# Altium project Twintig-Carpus.PrjPcb
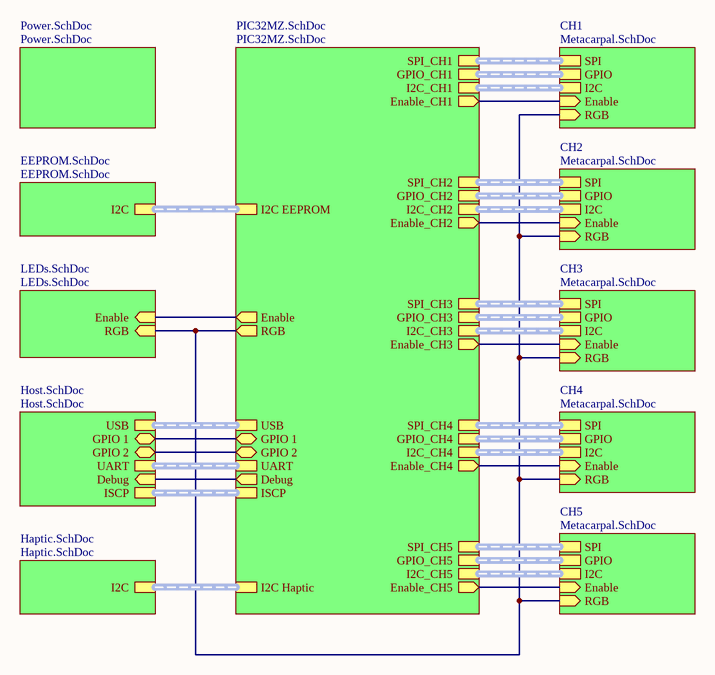
[diagram p0: Main.SchDoc]
Version: v1.0.1; Project: Twintig Carpus; Author: Seb Madgwick
8 sheets, 72 parts. Net scope: hierarchical (ports join the sheet entries above them; power ports are global).
Board file: Twintig-Carpus.PcbDoc
Sheets:
  Main.SchDoc
    PIC32MZ.SchDoc = PIC32MZ.SchDoc
    Power.SchDoc = Power.SchDoc
    CH1 = Metacarpal.SchDoc
    EEPROM.SchDoc = EEPROM.SchDoc
    LEDs.SchDoc = LEDs.SchDoc
    Haptic.SchDoc = Haptic.SchDoc
    Host.SchDoc = Host.SchDoc
    CH2 = Metacarpal.SchDoc
    CH3 = Metacarpal.SchDoc
    CH4 = Metacarpal.SchDoc
    CH5 = Metacarpal.SchDoc

## Sheet Main.SchDoc
size A4; SheetNumber: 1; SheetTotal: 8

### Sub-sheets
CH1 = Metacarpal.SchDoc: I2C (harness I2C), SPI (harness SPI), GPIO (harness GPIO), RGB (in), Enable (in)
CH2 = Metacarpal.SchDoc: I2C (harness I2C), SPI (harness SPI), GPIO (harness GPIO), RGB (in), Enable (in)
CH3 = Metacarpal.SchDoc: I2C (harness I2C), SPI (harness SPI), GPIO (harness GPIO), RGB (in), Enable (in)
CH4 = Metacarpal.SchDoc: I2C (harness I2C), SPI (harness SPI), GPIO (harness GPIO), RGB (in), Enable (in)
CH5 = Metacarpal.SchDoc: I2C (harness I2C), SPI (harness SPI), GPIO (harness GPIO), RGB (in), Enable (in)
EEPROM.SchDoc = EEPROM.SchDoc: I2C (harness I2C)
Haptic.SchDoc = Haptic.SchDoc: I2C (harness I2C)
Host.SchDoc = Host.SchDoc: UART (harness UART), USB (harness USB), ISCP (harness ICSP), Debug (in), GPIO 1 (bidir), GPIO 2 (bidir)
LEDs.SchDoc = LEDs.SchDoc: RGB (in), Enable (in)
PIC32MZ.SchDoc = PIC32MZ.SchDoc: I2C EEPROM (harness I2C), I2C Haptic (harness I2C), SPI_CH1 (harness SPI), GPIO_CH1 (harness GPIO), I2C_CH1 (harness I2C), SPI_CH2 (harness SPI), GPIO_CH2 (harness GPIO), I2C_CH2 (harness I2C), SPI_CH3 (harness SPI), GPIO_CH3 (harness GPIO), I2C_CH3 (harness I2C), SPI_CH4 (harness SPI), GPIO_CH4 (harness GPIO), I2C_CH4 (harness I2C), SPI_CH5 (harness SPI), GPIO_CH5 (harness GPIO), I2C_CH5 (harness I2C), UART (harness UART), USB (harness USB), ISCP (harness ICSP), RGB (out), Enable (out), Enable_CH1 (out), Enable_CH2 (out), Enable_CH5 (out), Enable_CH4 (out), Enable_CH3 (out), Debug (out), GPIO 2 (bidir), GPIO 1 (bidir)
Power.SchDoc = Power.SchDoc: no entries

### Nets
Debug: sheet PIC32MZ.SchDoc/Debug, sheet Host.SchDoc/Debug
Enable: sheet PIC32MZ.SchDoc/Enable_CH5, sheet CH5/Enable
Enable: sheet PIC32MZ.SchDoc/Enable_CH4, sheet CH4/Enable  [a separate net that carries the same name]
Enable: sheet PIC32MZ.SchDoc/Enable_CH3, sheet CH3/Enable  [a separate net that carries the same name]
Enable: sheet PIC32MZ.SchDoc/Enable_CH2, sheet CH2/Enable  [a separate net that carries the same name]
Enable: sheet PIC32MZ.SchDoc/Enable_CH1, sheet CH1/Enable  [a separate net that carries the same name]
Enable: sheet PIC32MZ.SchDoc/Enable, sheet LEDs.SchDoc/Enable  [a separate net that carries the same name]
GPIO 1: sheet PIC32MZ.SchDoc/GPIO 1, sheet Host.SchDoc/GPIO 1
GPIO 2: sheet PIC32MZ.SchDoc/GPIO 2, sheet Host.SchDoc/GPIO 2
RGB: sheet PIC32MZ.SchDoc/RGB, sheet CH1/RGB, sheet LEDs.SchDoc/RGB, sheet CH2/RGB, sheet CH3/RGB, sheet CH4/RGB, sheet CH5/RGB

### Buses and harness runs
harness sheet CH1/GPIO = sheet PIC32MZ.SchDoc/GPIO_CH1
harness sheet CH1/I2C = sheet PIC32MZ.SchDoc/I2C_CH1
harness sheet CH1/SPI = sheet PIC32MZ.SchDoc/SPI_CH1
harness sheet CH2/GPIO = sheet PIC32MZ.SchDoc/GPIO_CH2
harness sheet CH2/I2C = sheet PIC32MZ.SchDoc/I2C_CH2
harness sheet CH2/SPI = sheet PIC32MZ.SchDoc/SPI_CH2
harness sheet CH3/GPIO = sheet PIC32MZ.SchDoc/GPIO_CH3
harness sheet CH3/I2C = sheet PIC32MZ.SchDoc/I2C_CH3
harness sheet CH3/SPI = sheet PIC32MZ.SchDoc/SPI_CH3
harness sheet CH4/GPIO = sheet PIC32MZ.SchDoc/GPIO_CH4
harness sheet CH4/I2C = sheet PIC32MZ.SchDoc/I2C_CH4
harness sheet CH4/SPI = sheet PIC32MZ.SchDoc/SPI_CH4
harness sheet CH5/GPIO = sheet PIC32MZ.SchDoc/GPIO_CH5
harness sheet CH5/I2C = sheet PIC32MZ.SchDoc/I2C_CH5
harness sheet CH5/SPI = sheet PIC32MZ.SchDoc/SPI_CH5
harness sheet EEPROM.SchDoc/I2C = sheet PIC32MZ.SchDoc/I2C EEPROM
harness sheet Haptic.SchDoc/I2C = sheet PIC32MZ.SchDoc/I2C Haptic
harness sheet Host.SchDoc/ISCP = sheet PIC32MZ.SchDoc/ISCP
harness sheet Host.SchDoc/UART = sheet PIC32MZ.SchDoc/UART
harness sheet Host.SchDoc/USB = sheet PIC32MZ.SchDoc/USB

### Notes on the sheet
- TITLE
- SIZE
- A4
- VARIANT
- PROJECT
- SHEET
- VERSION
- OF
- AUTHOR
- DATE

## Sheet PIC32MZ.SchDoc
size A3; SheetNumber: 2; SheetTotal: 8
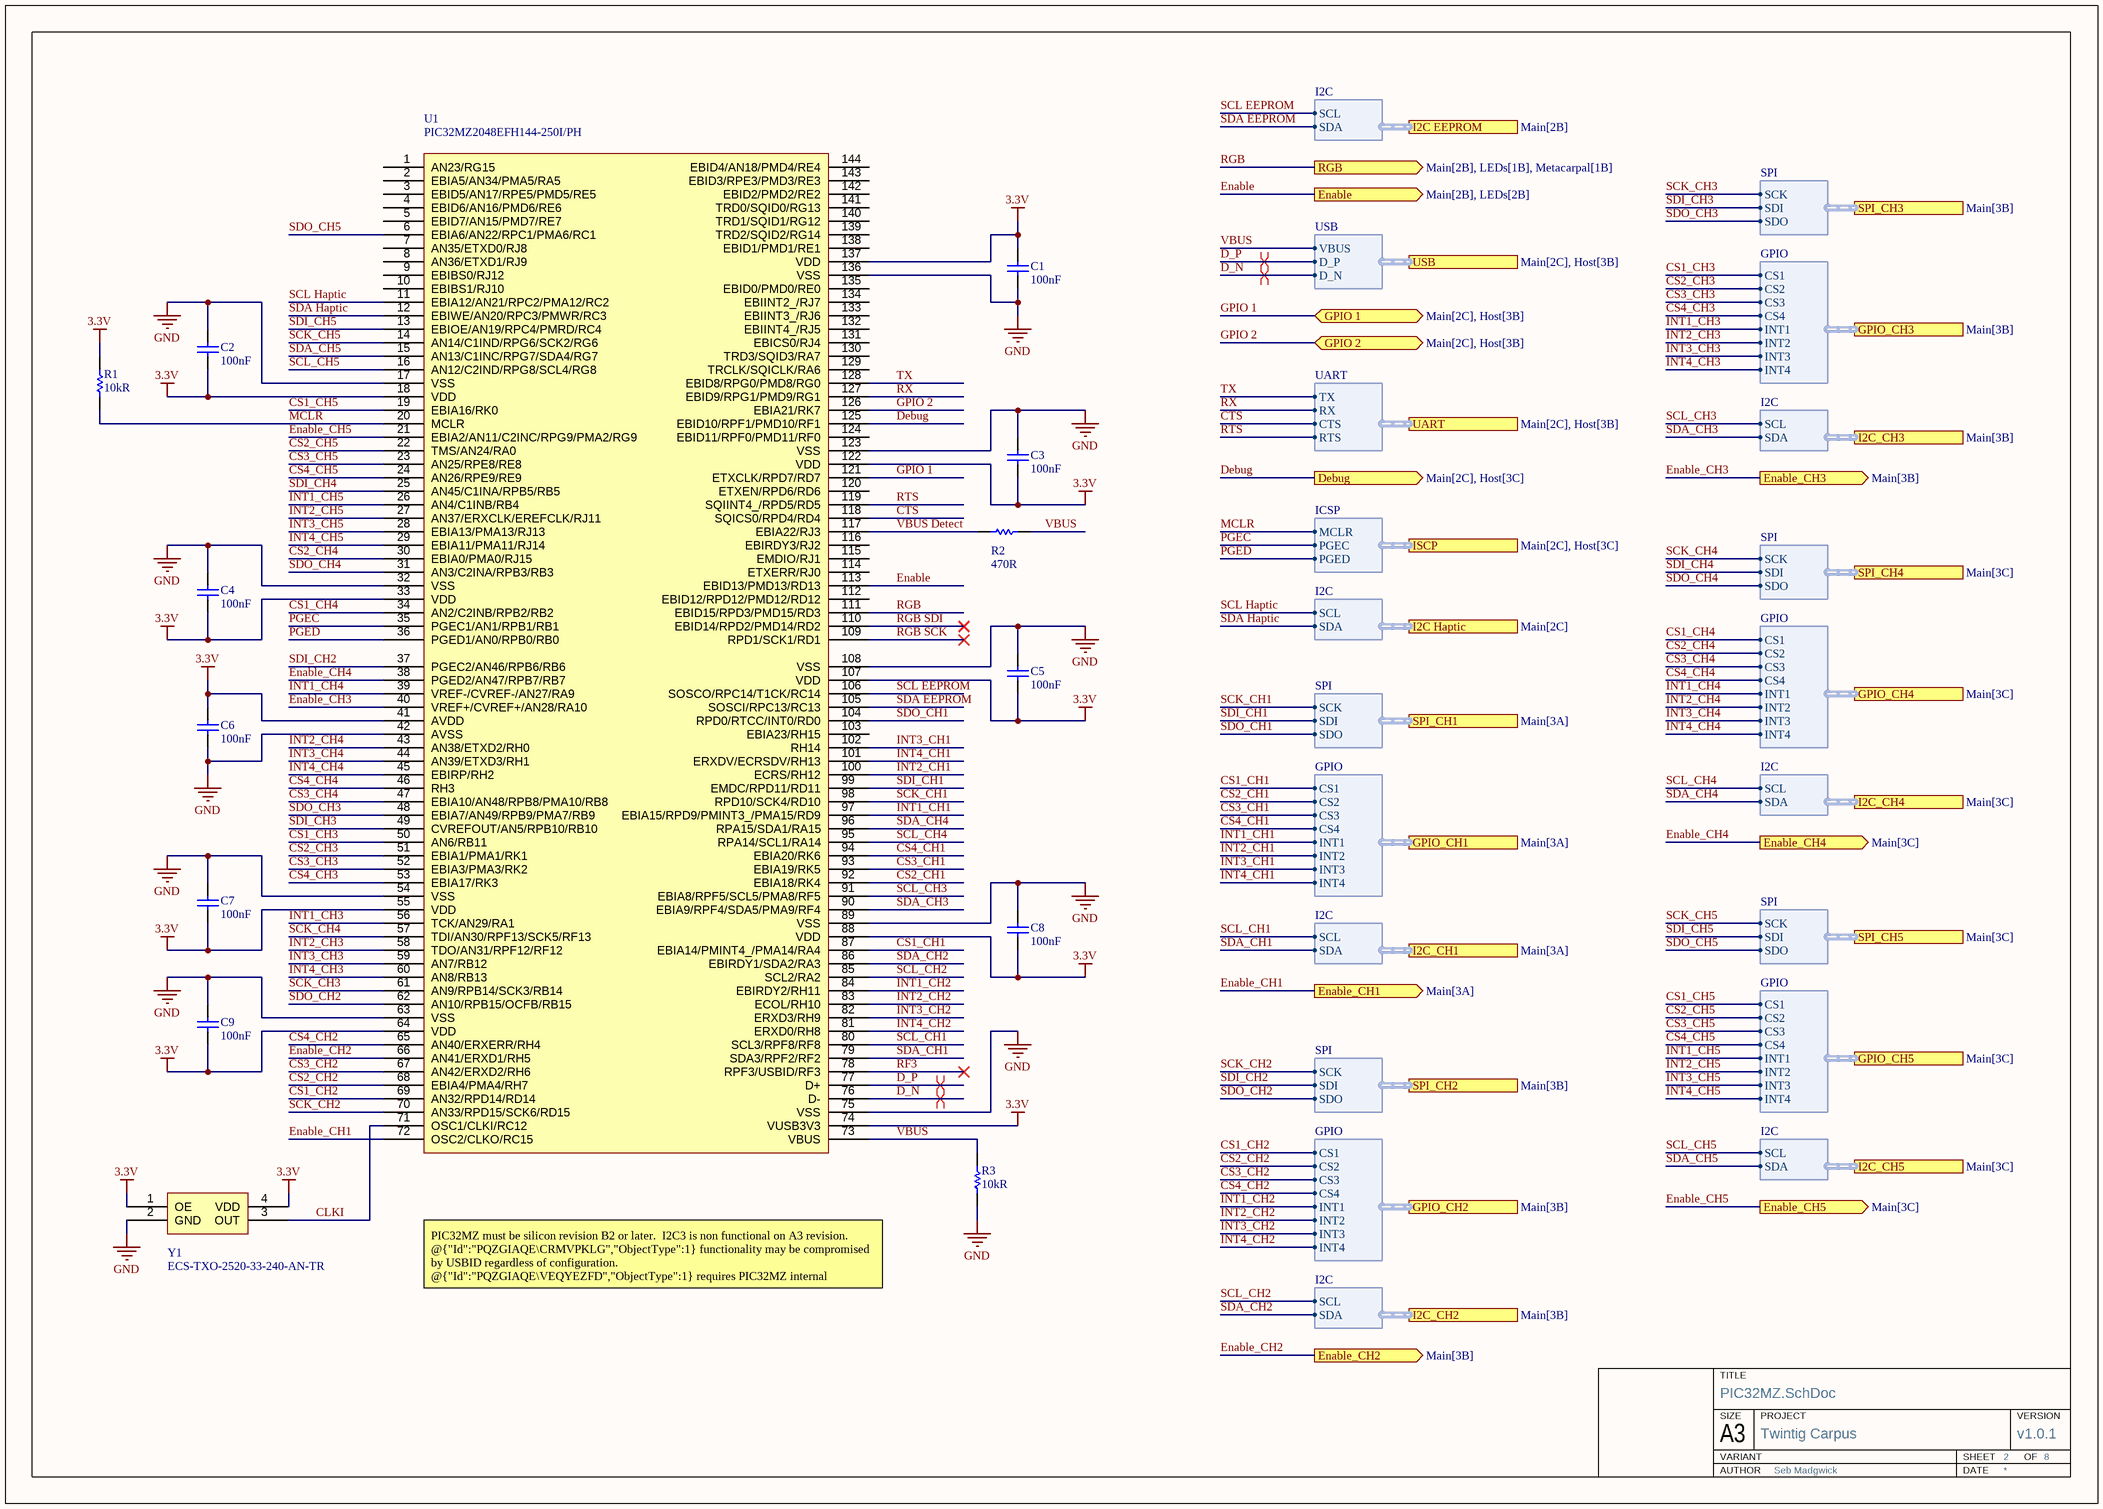
[diagram p1: PIC32MZ.SchDoc]

### Parts
C1  100nF  [Capacitor 0402]
C2  100nF  [Capacitor 0402]
C3  100nF  [Capacitor 0402]
C4  100nF  [Capacitor 0402]
C5  100nF  [Capacitor 0402]
C6  100nF  [Capacitor 0402]
C7  100nF  [Capacitor 0402]
C8  100nF  [Capacitor 0402]
C9  100nF  [Capacitor 0402]
R1  10kR  [Resistor 0402]
R2  470R  [Resistor 0402]
R3  10kR  [Resistor 0402]
U1  PIC32MZ2048EFH144-250I/PH  [TQFP-144 0.4mm]
Y1  ECS-TXO-2520-33-240-AN-TR  [ECS 2x2.5mm]

### Ports
Debug (out, see Main[2C], Host[3C]), Enable (out, see Main[2B], LEDs[2B]), Enable_CH1 (out, see Main[3A]), Enable_CH2 (out, see Main[3B]), Enable_CH3 (out, see Main[3B]), Enable_CH4 (out, see Main[3C]), Enable_CH5 (out, see Main[3C]), GPIO 1 (bidir, see Main[2C], Host[3B]), GPIO 2 (bidir, see Main[2C], Host[3B]), GPIO_CH1 (harness GPIO, see Main[3A]), GPIO_CH2 (harness GPIO, see Main[3B]), GPIO_CH3 (harness GPIO, see Main[3B]), GPIO_CH4 (harness GPIO, see Main[3C]), GPIO_CH5 (harness GPIO, see Main[3C]), I2C EEPROM (harness I2C, see Main[2B]), I2C Haptic (harness I2C, see Main[2C]), I2C_CH1 (harness I2C, see Main[3A]), I2C_CH2 (harness I2C, see Main[3B]), I2C_CH3 (harness I2C, see Main[3B]), I2C_CH4 (harness I2C, see Main[3C]), I2C_CH5 (harness I2C, see Main[3C]), ISCP (harness ICSP, see Main[2C], Host[3C]), RGB (out, see Main[2B], LEDs[1B], Metacarpal[1B]), SPI_CH1 (harness SPI, see Main[3A]), SPI_CH2 (harness SPI, see Main[3B]), SPI_CH3 (harness SPI, see Main[3B]), SPI_CH4 (harness SPI, see Main[3C]), SPI_CH5 (harness SPI, see Main[3C]), UART (harness UART, see Main[2C], Host[3B]), USB (harness USB, see Main[2C], Host[3B])

### Harnesses
I2C: SCL, SDA
SPI: SCK, SDI, SDO
GPIO: CS1, CS2, CS3, CS4, INT1, INT2, INT3, INT4
UART: TX, RX, CTS, RTS
USB: VBUS, D_P, D_N
ICSP: MCLR, PGEC, PGED

### Nets
3.3V: C1.2 C2.1 C3.1 C4.1 C5.1 C6.2 C7.1 C8.1 C9.1 R1.2 U1.18(VDD) U1.33(VDD) U1.41(AVDD) U1.55(VDD) U1.64(VDD) U1.74(VUSB3V3) U1.88(VDD) U1.107(VDD) U1.122(VDD) U1.137(VDD) Y1.1(OE) Y1.4(VDD)
GND: C1.1 C2.2 C3.2 C4.2 C5.2 C6.1 C7.2 C8.2 C9.2 R3.1 U1.17(VSS) U1.32(VSS) U1.42(AVSS) U1.54(VSS) U1.63(VSS) U1.75(VSS) U1.89(VSS) U1.108(VSS) U1.123(VSS) U1.136(VSS) Y1.2(GND)
CLKI: U1.71(OSC1/CLKI/RC12) Y1.3(OUT)
CS1_CH1: U1.87(EBIA14/PMINT4_/PMA14/RA4) ; port GPIO_CH1.CS1  [project net CS1]
CS1_CH2: U1.69(AN32/RPD14/RD14) ; port GPIO_CH2.CS1  [project net CS1]
CS1_CH3: U1.50(AN6/RB11) ; port GPIO_CH3.CS1  [project net CS1]
CS1_CH4: U1.34(AN2/C2INB/RPB2/RB2) ; port GPIO_CH4.CS1  [project net CS1]
CS1_CH5: U1.19(EBIA16/RK0) ; port GPIO_CH5.CS1  [project net CS1]
CS2_CH1: U1.92(EBIA18/RK4) ; port GPIO_CH1.CS2  [project net CS2]
CS2_CH2: U1.68(EBIA4/PMA4/RH7) ; port GPIO_CH2.CS2  [project net CS2]
CS2_CH3: U1.51(EBIA1/PMA1/RK1) ; port GPIO_CH3.CS2  [project net CS2]
CS2_CH4: U1.30(EBIA0/PMA0/RJ15) ; port GPIO_CH4.CS2  [project net CS2]
CS2_CH5: U1.22(TMS/AN24/RA0) ; port GPIO_CH5.CS2  [project net CS2]
CS3_CH1: U1.93(EBIA19/RK5) ; port GPIO_CH1.CS3  [project net CS3]
CS3_CH2: U1.67(AN42/ERXD2/RH6) ; port GPIO_CH2.CS3  [project net CS3]
CS3_CH3: U1.52(EBIA3/PMA3/RK2) ; port GPIO_CH3.CS3  [project net CS3]
CS3_CH4: U1.47(EBIA10/AN48/RPB8/PMA10/RB8) ; port GPIO_CH4.CS3  [project net CS3]
CS3_CH5: U1.23(AN25/RPE8/RE8) ; port GPIO_CH5.CS3  [project net CS3]
CS4_CH1: U1.94(EBIA20/RK6) ; port GPIO_CH1.CS4  [project net CS4]
CS4_CH2: U1.65(AN40/ERXERR/RH4) ; port GPIO_CH2.CS4  [project net CS4]
CS4_CH3: U1.53(EBIA17/RK3) ; port GPIO_CH3.CS4  [project net CS4]
CS4_CH4: U1.46(RH3) ; port GPIO_CH4.CS4  [project net CS4]
CS4_CH5: U1.24(AN26/RPE9/RE9) ; port GPIO_CH5.CS4  [project net CS4]
CTS: U1.118(SQICS0/RPD4/RD4) ; port UART.CTS
D_N: U1.76(D-) ; port USB.D_N
D_P: U1.77(D+) ; port USB.D_P
Debug: U1.125(EBID10/RPF1/PMD10/RF1) ; port Debug
Enable: U1.113(EBID13/PMD13/RD13) ; port Enable
Enable_CH1: U1.72(OSC2/CLKO/RC15) ; port Enable_CH1  [project net Enable]
Enable_CH2: U1.66(AN41/ERXD1/RH5) ; port Enable_CH2  [project net Enable]
Enable_CH3: U1.40(VREF+/CVREF+/AN28/RA10) ; port Enable_CH3  [project net Enable]
Enable_CH4: U1.38(PGED2/AN47/RPB7/RB7) ; port Enable_CH4  [project net Enable]
Enable_CH5: U1.21(EBIA2/AN11/C2INC/RPG9/PMA2/RG9) ; port Enable_CH5  [project net Enable]
GPIO 1: U1.121(ETXCLK/RPD7/RD7) ; port GPIO 1
GPIO 2: U1.126(EBIA21/RK7) ; port GPIO 2
INT1_CH1: U1.97(EBIA15/RPD9/PMINT3_/PMA15/RD9) ; port GPIO_CH1.INT1  [project net INT1]
INT1_CH2: U1.84(EBIRDY2/RH11) ; port GPIO_CH2.INT1  [project net INT1]
INT1_CH3: U1.56(TCK/AN29/RA1) ; port GPIO_CH3.INT1  [project net INT1]
INT1_CH4: U1.39(VREF-/CVREF-/AN27/RA9) ; port GPIO_CH4.INT1  [project net INT1]
INT1_CH5: U1.26(AN4/C1INB/RB4) ; port GPIO_CH5.INT1  [project net INT1]
INT2_CH1: U1.100(ECRS/RH12) ; port GPIO_CH1.INT2  [project net INT2]
INT2_CH2: U1.83(ECOL/RH10) ; port GPIO_CH2.INT2  [project net INT2]
INT2_CH3: U1.58(TDO/AN31/RPF12/RF12) ; port GPIO_CH3.INT2  [project net INT2]
INT2_CH4: U1.43(AN38/ETXD2/RH0) ; port GPIO_CH4.INT2  [project net INT2]
INT2_CH5: U1.27(AN37/ERXCLK/EREFCLK/RJ11) ; port GPIO_CH5.INT2  [project net INT2]
INT3_CH1: U1.102(RH14) ; port GPIO_CH1.INT3  [project net INT3]
INT3_CH2: U1.82(ERXD3/RH9) ; port GPIO_CH2.INT3  [project net INT3]
INT3_CH3: U1.59(AN7/RB12) ; port GPIO_CH3.INT3  [project net INT3]
INT3_CH4: U1.44(AN39/ETXD3/RH1) ; port GPIO_CH4.INT3  [project net INT3]
INT3_CH5: U1.28(EBIA13/PMA13/RJ13) ; port GPIO_CH5.INT3  [project net INT3]
INT4_CH1: U1.101(ERXDV/ECRSDV/RH13) ; port GPIO_CH1.INT4  [project net INT4]
INT4_CH2: U1.81(ERXD0/RH8) ; port GPIO_CH2.INT4  [project net INT4]
INT4_CH3: U1.60(AN8/RB13) ; port GPIO_CH3.INT4  [project net INT4]
INT4_CH4: U1.45(EBIRP/RH2) ; port GPIO_CH4.INT4  [project net INT4]
INT4_CH5: U1.29(EBIA11/PMA11/RJ14) ; port GPIO_CH5.INT4  [project net INT4]
MCLR: R1.1 U1.20(MCLR) ; port ISCP.MCLR
PGEC: U1.35(PGEC1/AN1/RPB1/RB1) ; port ISCP.PGEC
PGED: U1.36(PGED1/AN0/RPB0/RB0) ; port ISCP.PGED
RF3: U1.78(RPF3/USBID/RF3)
RGB: U1.111(EBID15/RPD3/PMD15/RD3) ; port RGB
RGB SCK: U1.109(RPD1/SCK1/RD1)
RGB SDI: U1.110(EBID14/RPD2/PMD14/RD2)
RTS: U1.119(SQIINT4_/RPD5/RD5) ; port UART.RTS
RX: U1.127(EBID9/RPG1/PMD9/RG1) ; port UART.RX
SCK_CH1: U1.98(RPD10/SCK4/RD10) ; port SPI_CH1.SCK  [project net SCK]
SCK_CH2: U1.70(AN33/RPD15/SCK6/RD15) ; port SPI_CH2.SCK  [project net SCK]
SCK_CH3: U1.61(AN9/RPB14/SCK3/RB14) ; port SPI_CH3.SCK  [project net SCK]
SCK_CH4: U1.57(TDI/AN30/RPF13/SCK5/RF13) ; port SPI_CH4.SCK  [project net SCK]
SCK_CH5: U1.14(AN14/C1IND/RPG6/SCK2/RG6) ; port SPI_CH5.SCK  [project net SCK]
SCL EEPROM: U1.106(SOSCO/RPC14/T1CK/RC14) ; port I2C EEPROM.SCL
SCL Haptic: U1.11(EBIA12/AN21/RPC2/PMA12/RC2) ; port I2C Haptic.SCL
SCL_CH1: U1.80(SCL3/RPF8/RF8) ; port I2C_CH1.SCL  [project net SCL]
SCL_CH2: U1.85(SCL2/RA2) ; port I2C_CH2.SCL  [project net SCL]
SCL_CH3: U1.91(EBIA8/RPF5/SCL5/PMA8/RF5) ; port I2C_CH3.SCL  [project net SCL]
SCL_CH4: U1.95(RPA14/SCL1/RA14) ; port I2C_CH4.SCL  [project net SCL]
SCL_CH5: U1.16(AN12/C2IND/RPG8/SCL4/RG8) ; port I2C_CH5.SCL  [project net SCL]
SDA EEPROM: U1.105(SOSCI/RPC13/RC13)
SDA Haptic: U1.12(EBIWE/AN20/RPC3/PMWR/RC3)
SDA_CH1: U1.79(SDA3/RPF2/RF2)
SDA_CH2: U1.86(EBIRDY1/SDA2/RA3)
SDA_CH3: U1.90(EBIA9/RPF4/SDA5/PMA9/RF4)
SDA_CH4: U1.96(RPA15/SDA1/RA15)
SDA_CH5: U1.15(AN13/C1INC/RPG7/SDA4/RG7)
SDI_CH1: U1.99(EMDC/RPD11/RD11) ; port SPI_CH1.SDI  [project net SDI]
SDI_CH2: U1.37(PGEC2/AN46/RPB6/RB6) ; port SPI_CH2.SDI  [project net SDI]
SDI_CH3: U1.49(CVREFOUT/AN5/RPB10/RB10) ; port SPI_CH3.SDI  [project net SDI]
SDI_CH4: U1.25(AN45/C1INA/RPB5/RB5) ; port SPI_CH4.SDI  [project net SDI]
SDI_CH5: U1.13(EBIOE/AN19/RPC4/PMRD/RC4) ; port SPI_CH5.SDI  [project net SDI]
SDO_CH1: U1.104(RPD0/RTCC/INT0/RD0) ; port SPI_CH1.SDO  [project net SDO]
SDO_CH2: U1.62(AN10/RPB15/OCFB/RB15) ; port SPI_CH2.SDO  [project net SDO]
SDO_CH3: U1.48(EBIA7/AN49/RPB9/PMA7/RB9) ; port SPI_CH3.SDO  [project net SDO]
SDO_CH4: U1.31(AN3/C2INA/RPB3/RB3) ; port SPI_CH4.SDO  [project net SDO]
SDO_CH5: U1.6(EBIA6/AN22/RPC1/PMA6/RC1) ; port SPI_CH5.SDO  [project net SDO]
TX: U1.128(EBID8/RPG0/PMD8/RG0) ; port UART.TX
VBUS: R2.1 R3.2 U1.73(VBUS) ; port USB.VBUS
VBUS Detect: R2.2 U1.117(EBIA22/RJ3)

Not connected (* = marked no-connect by the designer): U1 1(AN23/RG15) 2(EBIA5/AN34/PMA5/RA5) 3(EBID5/AN17/RPE5/PMD5/RE5) 4(EBID6/AN16/PMD6/RE6) 5(EBID7/AN15/PMD7/RE7) 7(AN35/ETXD0/RJ8) 8(AN36/ETXD1/RJ9) 9(EBIBS0/RJ12) 10(EBIBS1/RJ10) 103(EBIA23/RH15) 112(EBID12/RPD12/PMD12/RD12) 114(ETXERR/RJ0) 115(EMDIO/RJ1) 116(EBIRDY3/RJ2) 120(ETXEN/RPD6/RD6) 124(EBID11/RPF0/PMD11/RF0) 129(TRCLK/SQICLK/RA6) 130(TRD3/SQID3/RA7) 131(EBICS0/RJ4) 132(EBIINT4_/RJ5) 133(EBIINT3_/RJ6) 134(EBIINT2_/RJ7) 135(EBID0/PMD0/RE0) 138(EBID1/PMD1/RE1) 139(TRD2/SQID2/RG14) 140(TRD1/SQID1/RG12) 141(TRD0/SQID0/RG13) 142(EBID2/PMD2/RE2) 143(EBID3/RPE3/PMD3/RE3) 144(EBID4/AN18/PMD4/RE4)

### Layout directives
differential pair: D_N, D_P

### Notes on the sheet
- PIC32MZ must be silicon revision B2 or later.  I2C3 is non functional on A3 revision.
  @{"Id":"PQZGIAQE\CRMVPKLG","ObjectType":1} functionality may be compromised by USBID regardless of configuration.
  @{"Id":"PQZGIAQE\VEQYEZFD","ObjectType":1} requires PIC32MZ internal pull-down to ensure @{"Id":"QSPHDPUG\XVWCFEXP","ObjectType":1} is idle low.
  @{"Id":"PQZGIAQE\REOEHRRV","ObjectType":1} will output SCK1 regardless of PPS configuration.
- TITLE
- SIZE
- A3
- VARIANT
- PROJECT
- SHEET
- VERSION
- OF
- AUTHOR
- DATE

### Library data of the parts
C1-C9 = Capacitor
R1-R3 = Resistor
Y1 = Oscillator

## Sheet Power.SchDoc
size A4; SheetNumber: 3; SheetTotal: 8
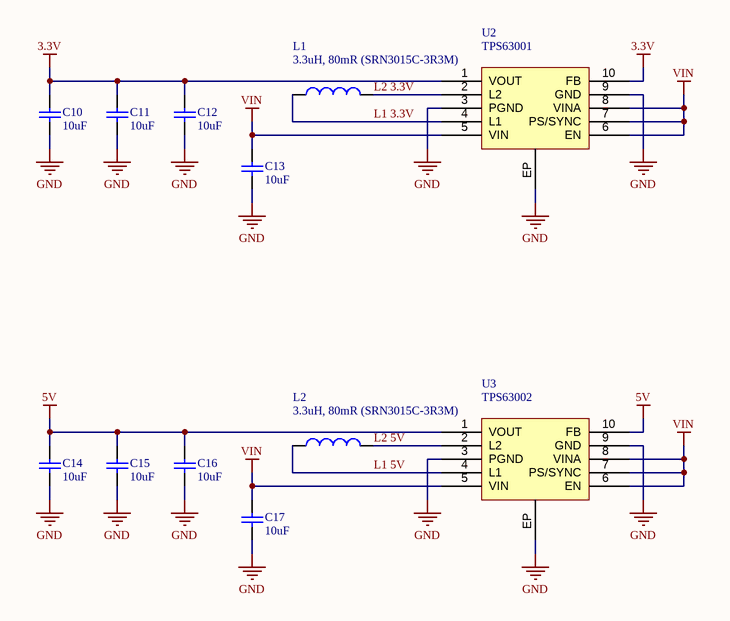
[diagram p2: Power.SchDoc]

### Parts
C10  10uF  [Capacitor 0402]
C11  10uF  [Capacitor 0402]
C12  10uF  [Capacitor 0402]
C13  10uF  [Capacitor 0402]
C14  10uF  [Capacitor 0402]
C15  10uF  [Capacitor 0402]
C16  10uF  [Capacitor 0402]
C17  10uF  [Capacitor 0402]
L1  3.3uH, 80mR (SRN3015C-3R3M)  [SRN3015C]
L2  3.3uH, 80mR (SRN3015C-3R3M)  [SRN3015C]
U2  TPS63001  [VSON-10]
U3  TPS63002  [VSON-10]

### Nets
3.3V: C10.2 C11.2 C12.2 U2.1(VOUT) U2.10(FB)
5V: C14.2 C15.2 C16.2 U3.1(VOUT) U3.10(FB)
GND: C10.1 C11.1 C12.1 C13.1 C14.1 C15.1 C16.1 C17.1 U2.3(PGND) U2.9(GND) U2.EP U3.3(PGND) U3.9(GND) U3.EP
VIN: C13.2 C17.2 U2.5(VIN) U2.6(EN) U2.7(PS/SYNC) U2.8(VINA) U3.5(VIN) U3.6(EN) U3.7(PS/SYNC) U3.8(VINA)
L1 3.3V: L1.1 U2.4(L1)
L1 5V: L2.1 U3.4(L1)
L2 3.3V: L1.2 U2.2(L2)
L2 5V: L2.2 U3.2(L2)

### Notes on the sheet
- TITLE
- SIZE
- A4
- VARIANT
- PROJECT
- SHEET
- VERSION
- OF
- AUTHOR
- DATE

### Library data of the parts
C10-C17 = Capacitor
L1 L2 = Inductor
U2 U3 = TPS630XX

## Sheet Metacarpal.SchDoc
size A4; SheetNumber: 8; SheetTotal: 8
Used 5 times, as channels CH1, CH2, CH3, CH4, CH5. Parts and nets are listed once, with the designators drawn on the sheet.
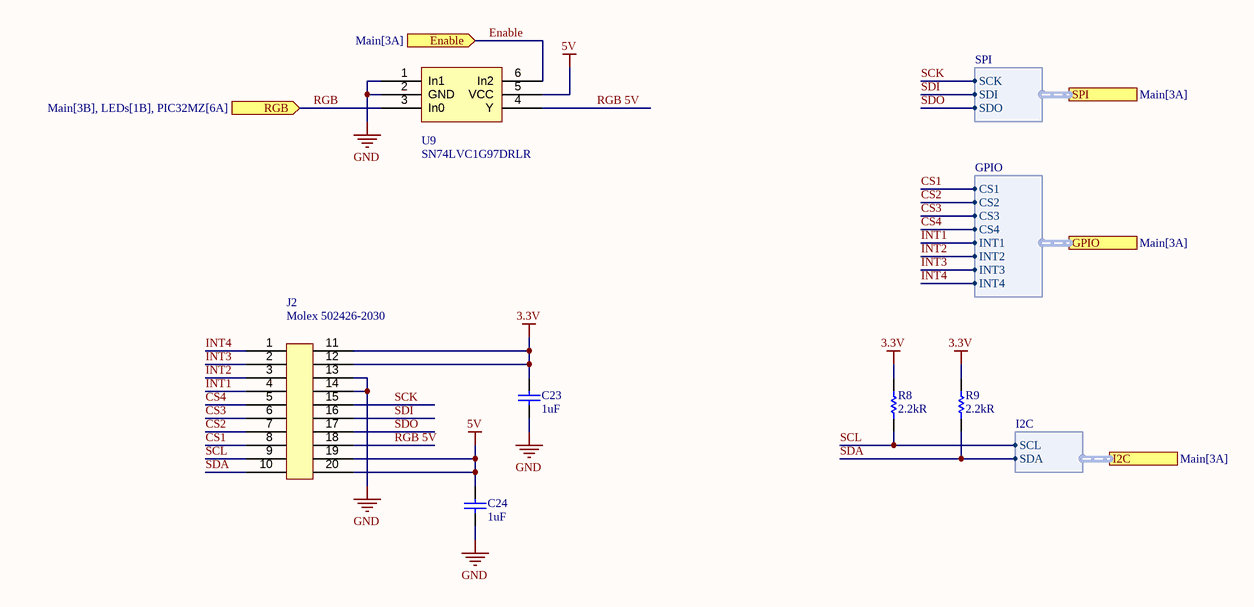
[diagram p3: Metacarpal.SchDoc]

### Parts
C23  1uF  [Capacitor 0402]
C24  1uF  [Capacitor 0402]
J2  Molex 502426-2030  [Molex 502426-2030]
R8  2.2kR  [Resistor 0402]
R9  2.2kR  [Resistor 0402]
U9  SN74LVC1G97DRLR  [SOT-666]

### Ports
Enable (in, see Main[3A]), GPIO (harness GPIO, see Main[3A]), I2C (harness I2C, see Main[3A]), RGB (in, see Main[3B], LEDs[1B], PIC32MZ[6A]), SPI (harness SPI, see Main[3A])

### Harnesses
SPI: SCK, SDI, SDO
GPIO: CS1, CS2, CS3, CS4, INT1, INT2, INT3, INT4
I2C: SCL, SDA

### Nets
3.3V: C23.2 J2.11 J2.12 R8.2 R9.2
5V: C24.2 J2.19 J2.20 U9.5(VCC)
GND: C23.1 C24.1 J2.13 J2.14 U9.1(In1) U9.2(GND)
CS1: J2.8 ; port GPIO.CS1
CS2: J2.7 ; port GPIO.CS2
CS3: J2.6 ; port GPIO.CS3
CS4: J2.5 ; port GPIO.CS4
Enable: U9.6(In2) ; port Enable
INT1: J2.4 ; port GPIO.INT1
INT2: J2.3 ; port GPIO.INT2
INT3: J2.2 ; port GPIO.INT3
INT4: J2.1 ; port GPIO.INT4
RGB: U9.3(In0) ; port RGB
RGB 5V: J2.18 U9.4(Y)
SCK: J2.15 ; port SPI.SCK
SCL: J2.9 R8.1 ; port I2C.SCL
SDA: J2.10 R9.1
SDI: J2.16 ; port SPI.SDI
SDO: J2.17 ; port SPI.SDO

### Channels
CH1: designators end in _CH1; ports Enable=Enable RGB=RGB
CH2: designators end in _CH2; ports Enable=Enable RGB=RGB
CH3: designators end in _CH3; ports Enable=Enable RGB=RGB
CH4: designators end in _CH4; ports Enable=Enable RGB=RGB
CH5: designators end in _CH5; ports Enable=Enable RGB=RGB

### Notes on the sheet
- TITLE
- SIZE
- A4
- VARIANT
- PROJECT
- SHEET
- VERSION
- OF
- AUTHOR
- DATE

### Library data of the parts
C23 C24 = Capacitor
R8 R9 = Resistor

## Sheet EEPROM.SchDoc
size A4; SheetNumber: 4; SheetTotal: 8
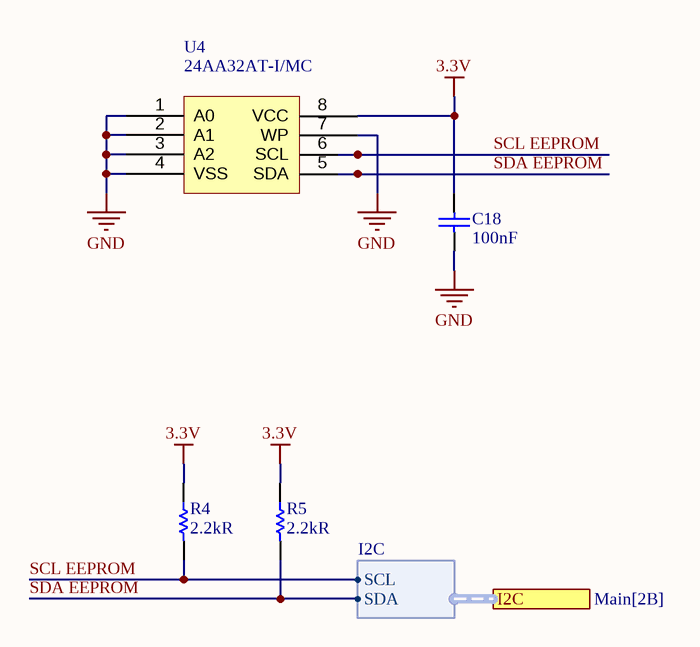
[diagram p4: EEPROM.SchDoc]

### Parts
C18  100nF  [Capacitor 0402]
R4  2.2kR  [Resistor 0402]
R5  2.2kR  [Resistor 0402]
U4  24AA32AT-I/MC  [TDFN-8 2x3mm]

### Ports
I2C (harness I2C, see Main[2B])

### Harnesses
I2C: SCL, SDA

### Nets
3.3V: C18.2 R4.2 R5.2 U4.8(VCC)
GND: C18.1 U4.1(A0) U4.2(A1) U4.3(A2) U4.4(VSS) U4.7(WP)
SCL EEPROM: R4.1 U4.6(SCL) ; port I2C.SCL
SDA EEPROM: R5.1 U4.5(SDA)

### Notes on the sheet
- TITLE
- SIZE
- A4
- VARIANT
- PROJECT
- SHEET
- VERSION
- OF
- AUTHOR
- DATE

### Library data of the parts
C18 = Capacitor
R4 R5 = Resistor
U4 = 24AA32A

## Sheet LEDs.SchDoc
size A4; SheetNumber: 5; SheetTotal: 8
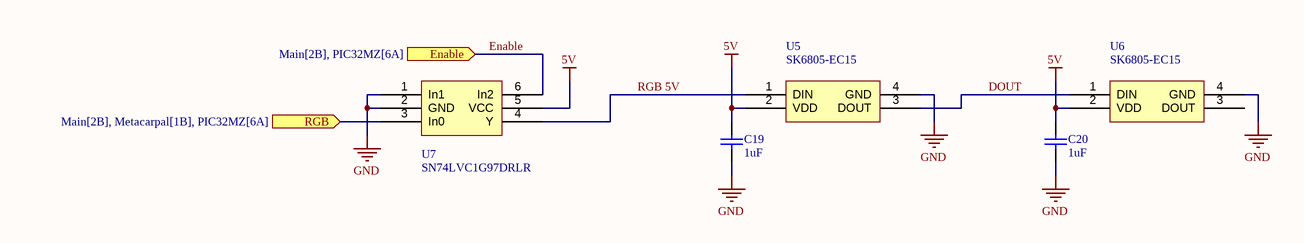
[diagram p5: LEDs.SchDoc]

### Parts
C19  1uF  [Capacitor 0402]
C20  1uF  [Capacitor 0402]
U5  SK6805-EC15  [SK6805-EC15]
U6  SK6805-EC15  [SK6805-EC15]
U7  SN74LVC1G97DRLR  [SOT-666]

### Ports
Enable (in, see Main[2B], PIC32MZ[6A]), RGB (in, see Main[2B], Metacarpal[1B], PIC32MZ[6A])

### Nets
5V: C19.2 C20.2 U5.2(VDD) U6.2(VDD) U7.5(VCC)
GND: C19.1 C20.1 U5.4(GND) U6.4(GND) U7.1(In1) U7.2(GND)
DOUT: U5.3(DOUT) U6.1(DIN)
Enable: U7.6(In2) ; port Enable
RGB: U7.3(In0) ; port RGB
RGB 5V: U5.1(DIN) U7.4(Y)

Not connected (* = marked no-connect by the designer): U6 3(DOUT)

### Notes on the sheet
- TITLE
- SIZE
- A4
- VARIANT
- PROJECT
- SHEET
- VERSION
- OF
- AUTHOR
- DATE

### Library data of the parts
C19 C20 = Capacitor

## Sheet Haptic.SchDoc
size A4; SheetNumber: 7; SheetTotal: 8
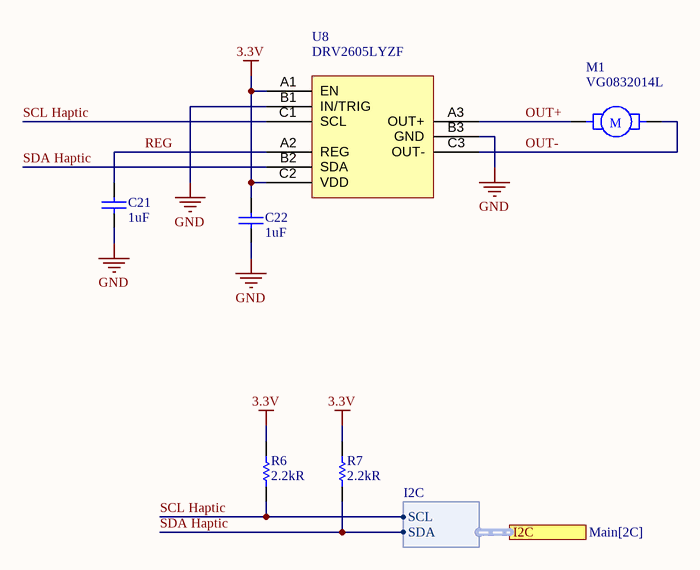
[diagram p6: Haptic.SchDoc]

### Parts
C21  1uF  [Capacitor 0402]
C22  1uF  [Capacitor 0402]
M1  VG0832014L  [VG0832014L]
R6  2.2kR  [Resistor 0402]
R7  2.2kR  [Resistor 0402]
U8  DRV2605LYZF  [DRV2605LYZF]

### Ports
I2C (harness I2C, see Main[2C])

### Harnesses
I2C: SCL, SDA

### Nets
3.3V: C22.2 R6.2 R7.2 U8.A1(EN) U8.C2(VDD)
GND: C21.1 C22.1 U8.B1(IN/TRIG) U8.B3(GND)
OUT+: M1.1 U8.A3(OUT+)
OUT-: M1.2 U8.C3(OUT-)
REG: C21.2 U8.A2(REG)
SCL Haptic: R6.1 U8.C1(SCL) ; port I2C.SCL
SDA Haptic: R7.1 U8.B2(SDA)

### Notes on the sheet
- TITLE
- SIZE
- A4
- VARIANT
- PROJECT
- SHEET
- VERSION
- OF
- AUTHOR
- DATE
- (in symbol VG0832014L) M

### Library data of the parts
C21 C22 = Capacitor
R6 R7 = Resistor

## Sheet Host.SchDoc
size A4; SheetNumber: 6; SheetTotal: 8
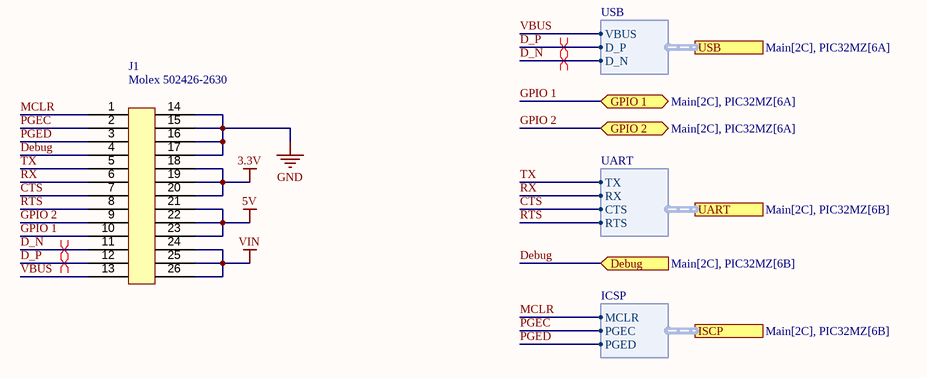
[diagram p7: Host.SchDoc]

### Parts
J1  Molex 502426-2630  [Molex 502426-2630]

### Ports
Debug (in, see Main[2C], PIC32MZ[6B]), GPIO 1 (bidir, see Main[2C], PIC32MZ[6A]), GPIO 2 (bidir, see Main[2C], PIC32MZ[6A]), ISCP (harness ICSP, see Main[2C], PIC32MZ[6B]), UART (harness UART, see Main[2C], PIC32MZ[6B]), USB (harness USB, see Main[2C], PIC32MZ[6A])

### Harnesses
UART: TX, RX, CTS, RTS
USB: VBUS, D_P, D_N
ICSP: MCLR, PGEC, PGED

### Nets
3.3V: J1.18 J1.19 J1.20
5V: J1.21 J1.22 J1.23
GND: J1.14 J1.15 J1.16 J1.17
VIN: J1.24 J1.25 J1.26
CTS: J1.7 ; port UART.CTS
D_N: J1.11 ; port USB.D_N
D_P: J1.12 ; port USB.D_P
Debug: J1.4 ; port Debug
GPIO 1: J1.10 ; port GPIO 1
GPIO 2: J1.9 ; port GPIO 2
MCLR: J1.1 ; port ISCP.MCLR
PGEC: J1.2 ; port ISCP.PGEC
PGED: J1.3 ; port ISCP.PGED
RTS: J1.8 ; port UART.RTS
RX: J1.6 ; port UART.RX
TX: J1.5 ; port UART.TX
VBUS: J1.13 ; port USB.VBUS

### Layout directives
differential pair: D_N, D_P

### Notes on the sheet
- TITLE
- SIZE
- A4
- VARIANT
- PROJECT
- SHEET
- VERSION
- OF
- AUTHOR
- DATE

## Nets that join several sheets
3.3V: PIC32MZ (22 pins), Power (5 pins), CH1 (5 pins), EEPROM (C18.2 R4.2 R5.2 U4.8), Haptic (5 pins), Host (J1.18 J1.19 J1.20), CH2 (5 pins), CH3 (5 pins), CH4 (5 pins), CH5 (5 pins)
5V: Power (5 pins), CH1 (C24_CH1.2 J2_CH1.19 J2_CH1.20 U9_CH1.5), LEDs (5 pins), Host (J1.21 J1.22 J1.23), CH2 (C24_CH2.2 J2_CH2.19 J2_CH2.20 U9_CH2.5), CH3 (C24_CH3.2 J2_CH3.19 J2_CH3.20 U9_CH3.5), CH4 (C24_CH4.2 J2_CH4.19 J2_CH4.20 U9_CH4.5), CH5 (C24_CH5.2 J2_CH5.19 J2_CH5.20 U9_CH5.5)
GND: PIC32MZ (21 pins), Power (14 pins), CH1 (6 pins), EEPROM (6 pins), LEDs (6 pins), Haptic (C21.1 C22.1 U8.B1 U8.B3), Host (J1.14 J1.15 J1.16 J1.17), CH2 (6 pins), CH3 (6 pins), CH4 (6 pins), CH5 (6 pins)
VIN: Power (10 pins), Host (J1.24 J1.25 J1.26)
CS1: PIC32MZ (U1.19), CH5 (J2_CH5.8)
CS1: PIC32MZ (U1.34), CH4 (J2_CH4.8)
CS1: PIC32MZ (U1.50), CH3 (J2_CH3.8)
CS1: PIC32MZ (U1.69), CH2 (J2_CH2.8)
CS1: PIC32MZ (U1.87), CH1 (J2_CH1.8)
CS2: PIC32MZ (U1.22), CH5 (J2_CH5.7)
CS2: PIC32MZ (U1.30), CH4 (J2_CH4.7)
CS2: PIC32MZ (U1.51), CH3 (J2_CH3.7)
CS2: PIC32MZ (U1.68), CH2 (J2_CH2.7)
CS2: PIC32MZ (U1.92), CH1 (J2_CH1.7)
CS3: PIC32MZ (U1.23), CH5 (J2_CH5.6)
CS3: PIC32MZ (U1.47), CH4 (J2_CH4.6)
CS3: PIC32MZ (U1.52), CH3 (J2_CH3.6)
CS3: PIC32MZ (U1.67), CH2 (J2_CH2.6)
CS3: PIC32MZ (U1.93), CH1 (J2_CH1.6)
CS4: PIC32MZ (U1.24), CH5 (J2_CH5.5)
CS4: PIC32MZ (U1.46), CH4 (J2_CH4.5)
CS4: PIC32MZ (U1.53), CH3 (J2_CH3.5)
CS4: PIC32MZ (U1.65), CH2 (J2_CH2.5)
CS4: PIC32MZ (U1.94), CH1 (J2_CH1.5)
CTS: PIC32MZ (U1.118), Host (J1.7)
D_N: PIC32MZ (U1.76), Host (J1.11)
D_P: PIC32MZ (U1.77), Host (J1.12)
Debug: PIC32MZ (U1.125), Host (J1.4)
Enable: PIC32MZ (U1.21), CH5 (U9_CH5.6)
Enable: PIC32MZ (U1.38), CH4 (U9_CH4.6)
Enable: PIC32MZ (U1.40), CH3 (U9_CH3.6)
Enable: PIC32MZ (U1.66), CH2 (U9_CH2.6)
Enable: PIC32MZ (U1.72), CH1 (U9_CH1.6)
Enable: PIC32MZ (U1.113), LEDs (U7.6)
GPIO 1: PIC32MZ (U1.121), Host (J1.10)
GPIO 2: PIC32MZ (U1.126), Host (J1.9)
INT1: PIC32MZ (U1.26), CH5 (J2_CH5.4)
INT1: PIC32MZ (U1.39), CH4 (J2_CH4.4)
INT1: PIC32MZ (U1.56), CH3 (J2_CH3.4)
INT1: PIC32MZ (U1.84), CH2 (J2_CH2.4)
INT1: PIC32MZ (U1.97), CH1 (J2_CH1.4)
INT2: PIC32MZ (U1.27), CH5 (J2_CH5.3)
INT2: PIC32MZ (U1.43), CH4 (J2_CH4.3)
INT2: PIC32MZ (U1.58), CH3 (J2_CH3.3)
INT2: PIC32MZ (U1.83), CH2 (J2_CH2.3)
INT2: PIC32MZ (U1.100), CH1 (J2_CH1.3)
INT3: PIC32MZ (U1.28), CH5 (J2_CH5.2)
INT3: PIC32MZ (U1.44), CH4 (J2_CH4.2)
INT3: PIC32MZ (U1.59), CH3 (J2_CH3.2)
INT3: PIC32MZ (U1.82), CH2 (J2_CH2.2)
INT3: PIC32MZ (U1.102), CH1 (J2_CH1.2)
INT4: PIC32MZ (U1.29), CH5 (J2_CH5.1)
INT4: PIC32MZ (U1.45), CH4 (J2_CH4.1)
INT4: PIC32MZ (U1.60), CH3 (J2_CH3.1)
INT4: PIC32MZ (U1.81), CH2 (J2_CH2.1)
INT4: PIC32MZ (U1.101), CH1 (J2_CH1.1)
MCLR: PIC32MZ (R1.1 U1.20), Host (J1.1)
PGEC: PIC32MZ (U1.35), Host (J1.2)
PGED: PIC32MZ (U1.36), Host (J1.3)
RGB: PIC32MZ (U1.111), CH1 (U9_CH1.3), LEDs (U7.3), CH2 (U9_CH2.3), CH3 (U9_CH3.3), CH4 (U9_CH4.3), CH5 (U9_CH5.3)
RTS: PIC32MZ (U1.119), Host (J1.8)
RX: PIC32MZ (U1.127), Host (J1.6)
SCK: PIC32MZ (U1.14), CH5 (J2_CH5.15)
SCK: PIC32MZ (U1.57), CH4 (J2_CH4.15)
SCK: PIC32MZ (U1.61), CH3 (J2_CH3.15)
SCK: PIC32MZ (U1.70), CH2 (J2_CH2.15)
SCK: PIC32MZ (U1.98), CH1 (J2_CH1.15)
SCL: PIC32MZ (U1.16), CH5 (J2_CH5.9 R8_CH5.1)
SCL: PIC32MZ (U1.80), CH1 (J2_CH1.9 R8_CH1.1)
SCL: PIC32MZ (U1.85), CH2 (J2_CH2.9 R8_CH2.1)
SCL: PIC32MZ (U1.91), CH3 (J2_CH3.9 R8_CH3.1)
SCL: PIC32MZ (U1.95), CH4 (J2_CH4.9 R8_CH4.1)
SCL EEPROM: PIC32MZ (U1.106), EEPROM (R4.1 U4.6)
SCL Haptic: PIC32MZ (U1.11), Haptic (R6.1 U8.C1)
SDI: PIC32MZ (U1.13), CH5 (J2_CH5.16)
SDI: PIC32MZ (U1.25), CH4 (J2_CH4.16)
SDI: PIC32MZ (U1.37), CH2 (J2_CH2.16)
SDI: PIC32MZ (U1.49), CH3 (J2_CH3.16)
SDI: PIC32MZ (U1.99), CH1 (J2_CH1.16)
SDO: PIC32MZ (U1.6), CH5 (J2_CH5.17)
SDO: PIC32MZ (U1.31), CH4 (J2_CH4.17)
SDO: PIC32MZ (U1.48), CH3 (J2_CH3.17)
SDO: PIC32MZ (U1.62), CH2 (J2_CH2.17)
SDO: PIC32MZ (U1.104), CH1 (J2_CH1.17)
TX: PIC32MZ (U1.128), Host (J1.5)
VBUS: PIC32MZ (R2.1 R3.2 U1.73), Host (J1.13)